# Altium schematic sheet BoutVoeding.SchDoc
size A4; SheetNumber: 5; SheetTotal: 5
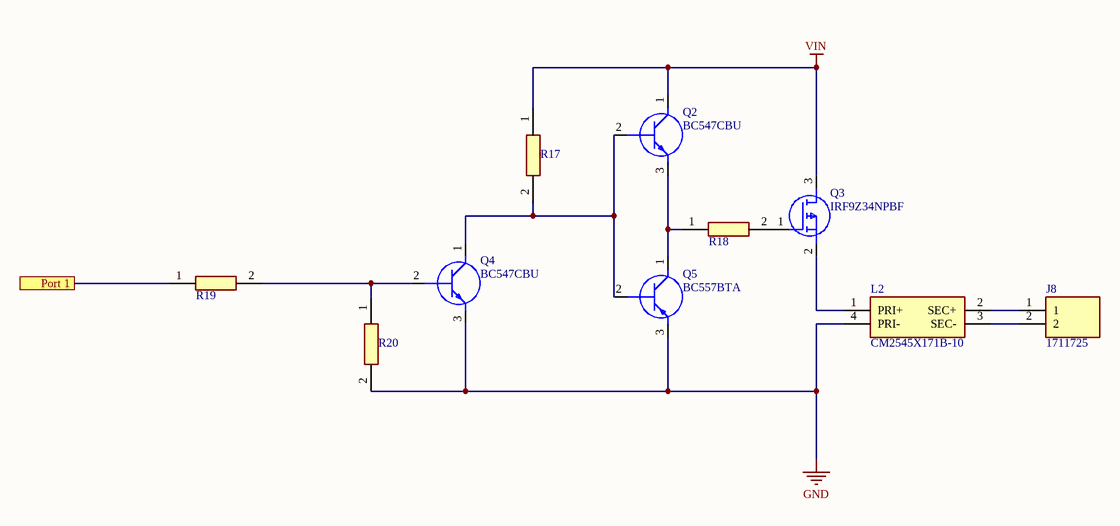
[diagram p0: BoutVoeding.SchDoc]

## Parts
J8  1711725  [1711725]
L2  CM2545X171B-10  [CM2545X171B10]
Q2  BC547CBU  [TTTT]
Q3  IRF9Z34NPBF  [T2]
Q4  BC547CBU  [TTTT]
Q5  BC557BTA  [TTTT]
R17  CRCW08054K70FKEAHP  [Resistor]  (value not drawn)
R18  CPF0805B18KE  [Resistor]  (value not drawn)
R19  CRCW080510K0DHEAP  [Resistor]  (value not drawn)
R20  CRCW08054K70FKEAHP  [Resistor]  (value not drawn)

## Ports
Port 1

## Nets
GND: L2.4(PRI-) Q4.3(E) Q5.3(E) R20.2
VIN: Q2.1(C) Q3.3(D) R17.1
Port 1: R19.1 ; port Port 1
NetJ8_1: J8.1 L2.2(SEC+)
NetJ8_2: J8.2 L2.3(SEC-)
NetL2_1: L2.1(PRI+) Q3.2(S)
NetQ2_2: Q2.2(B) Q4.1(C) Q5.2(B) R17.2
NetQ2_3: Q2.3(E) Q5.1(C) R18.1
NetQ3_1: Q3.1(G) R18.2
NetQ4_2: Q4.2(B) R19.2 R20.1

## Library data of the parts
J8 = 1711725: Connector; Manufacturer_Name: Phoenix Contact; Datasheet Link: http://www.phoenixcontact.com/de/produkte/1711725/pdf; Height: 18.2mm; Manufacturer_Part_Number: 1711725
L2 = CM2545X171B-10: Transformer; Manufacturer_Name: Laird Technologies; Datasheet Link: https://datasheet.datasheetarchive.com/originals/dk/DKDS-7/122753.pdf; Height: 9.5mm; Manufacturer_Part_Number: CM2545X171B-10
Q2 Q4 = BC547CBU: Transistor BJT NPN; Manufacturer_Name: ON Semiconductor; Datasheet Link: https://www.onsemi.com/pdf/datasheet/bc550-d.pdf; Height: 5.33mm; Manufacturer_Part_Number: BC547CBU
Q3 = IRF9Z34NPBF: MOSFET (P-Channel); Manufacturer_Name: Infineon; Datasheet Link: https://componentsearchengine.com//IRF9Z34NPBF.pdf; Height: 4.69mm; Mouser2 Part Number: 942-IRF9Z34NPBF; Mouser2 Price/Stock: https://www.mouser.com/Search/Refine.aspx?Keyword=942-IRF9Z34NPBF; Manufacturer_Part_Number: IRF9Z34NPBF
Q5 = BC557BTA: Transistor BJT PNP; Manufacturer_Name: ON Semiconductor; Datasheet Link: https://componentsearchengine.com//BC557BTA.pdf; Height: 4.19mm; Mouser2 Part Number: 512-BC557BTA; Mouser2 Price/Stock: https://www.mouser.com/Search/Refine.aspx?Keyword=512-BC557BTA; Manufacturer_Part_Number: BC557BTA
R17 R20 = CRCW08054K70FKEAHP: Resistor 4.7KOhm; Manufacturer_Name: Vishay; Datasheet Link: https://componentsearchengine.com//CRCW08054K70FKEAHP.pdf; Height: 0.5mm; Mouser2 Part Number: 71-CRCW08054K70FKEAH; Mouser2 Price/Stock: https://www.mouser.com/Search/Refine.aspx?Keyword=71-CRCW08054K70FKEAH; Manufacturer_Part_Number: CRCW08054K70FKEAHP
R18 = CPF0805B18KE: Resistor 100Ohm; Manufacturer_Name: TE Connectivity; Datasheet Link: https://datasheet.datasheetarchive.com/originals/distributors/DKDS-21/401696.pdf; Height: 0.65mm; Manufacturer_Part_Number: CPF0805B18KE
R19 = CRCW080510K0DHEAP: Resistor 10KOhm; Manufacturer_Name: Vishay; Datasheet Link: https://www.arrow.com/en/products/crcw080510k0dheap/vishay; Height: 0.5mm; Manufacturer_Part_Number: CRCW080510K0DHEAP